# EAGLE design IC Adapter 2x20 Panel (EAGLE 9.6.2)
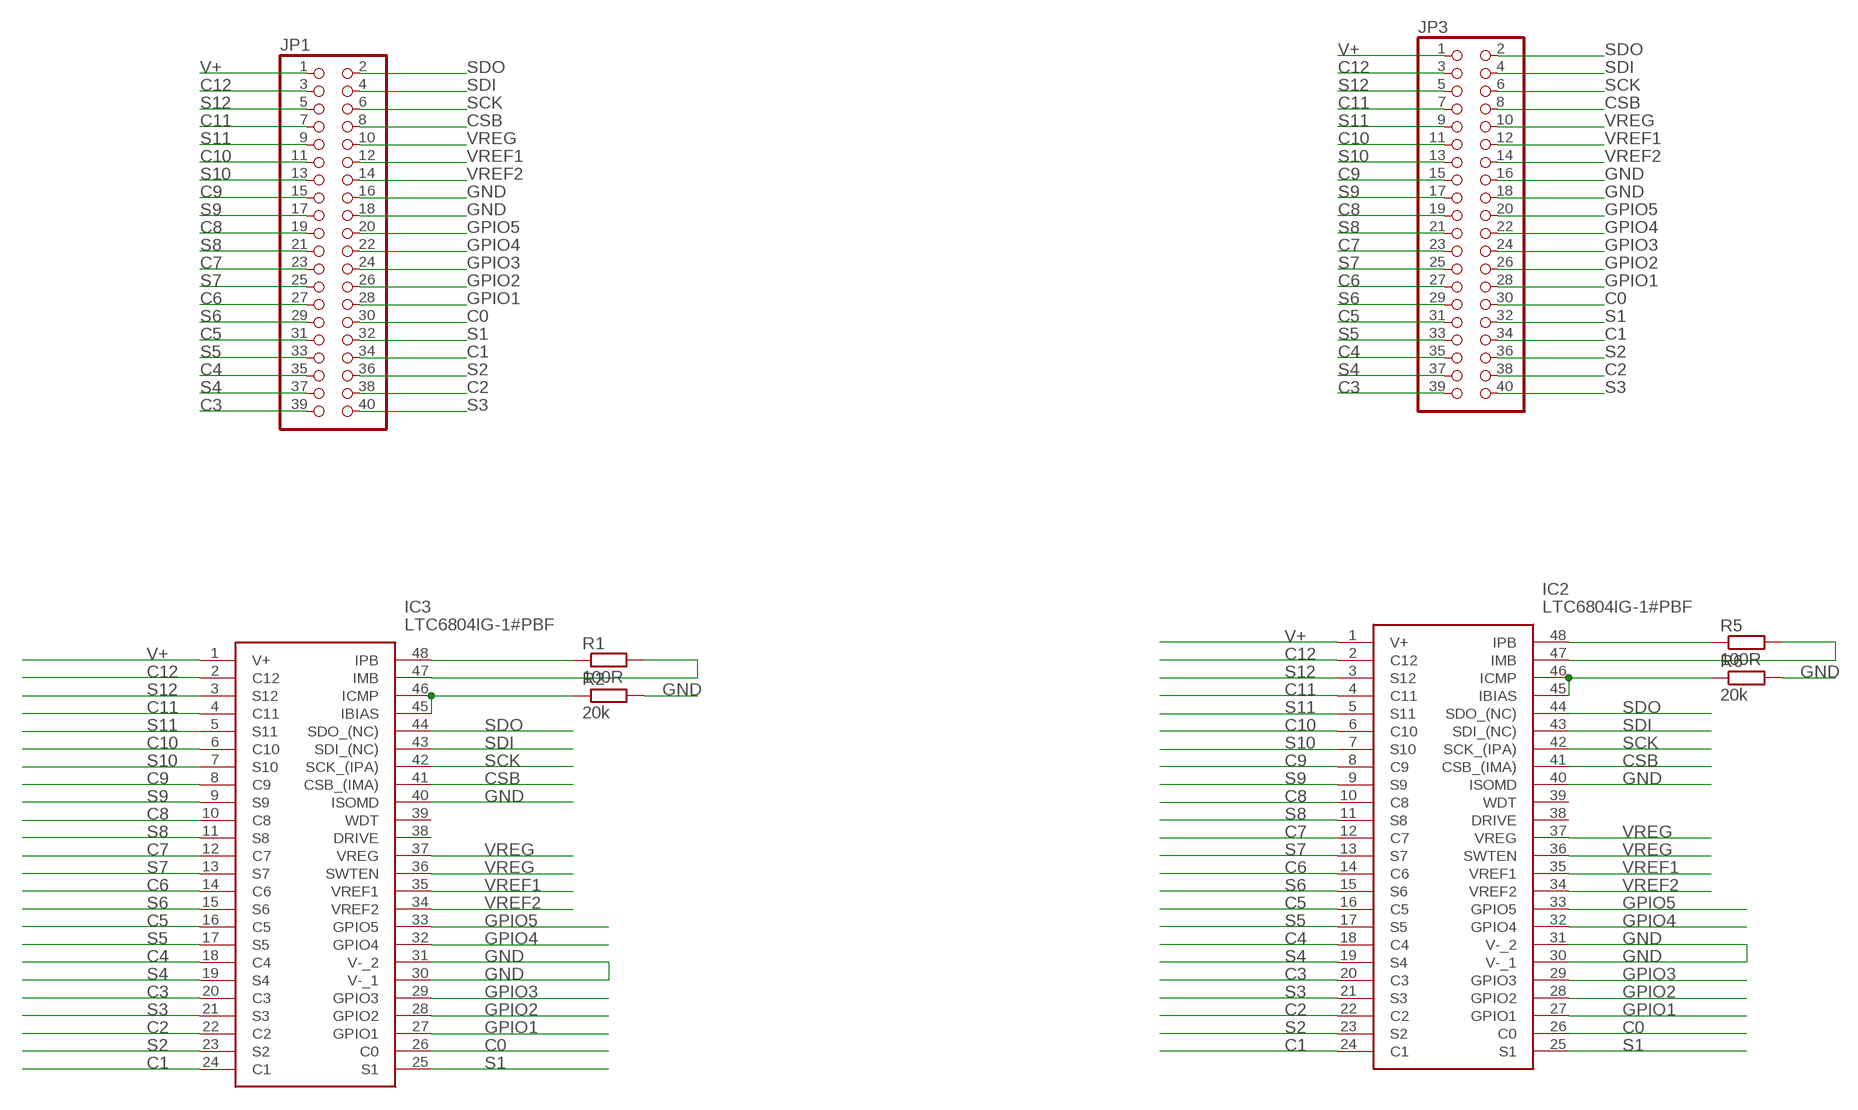
[diagram p0: schematic, sheet 1, part 1 of 2]
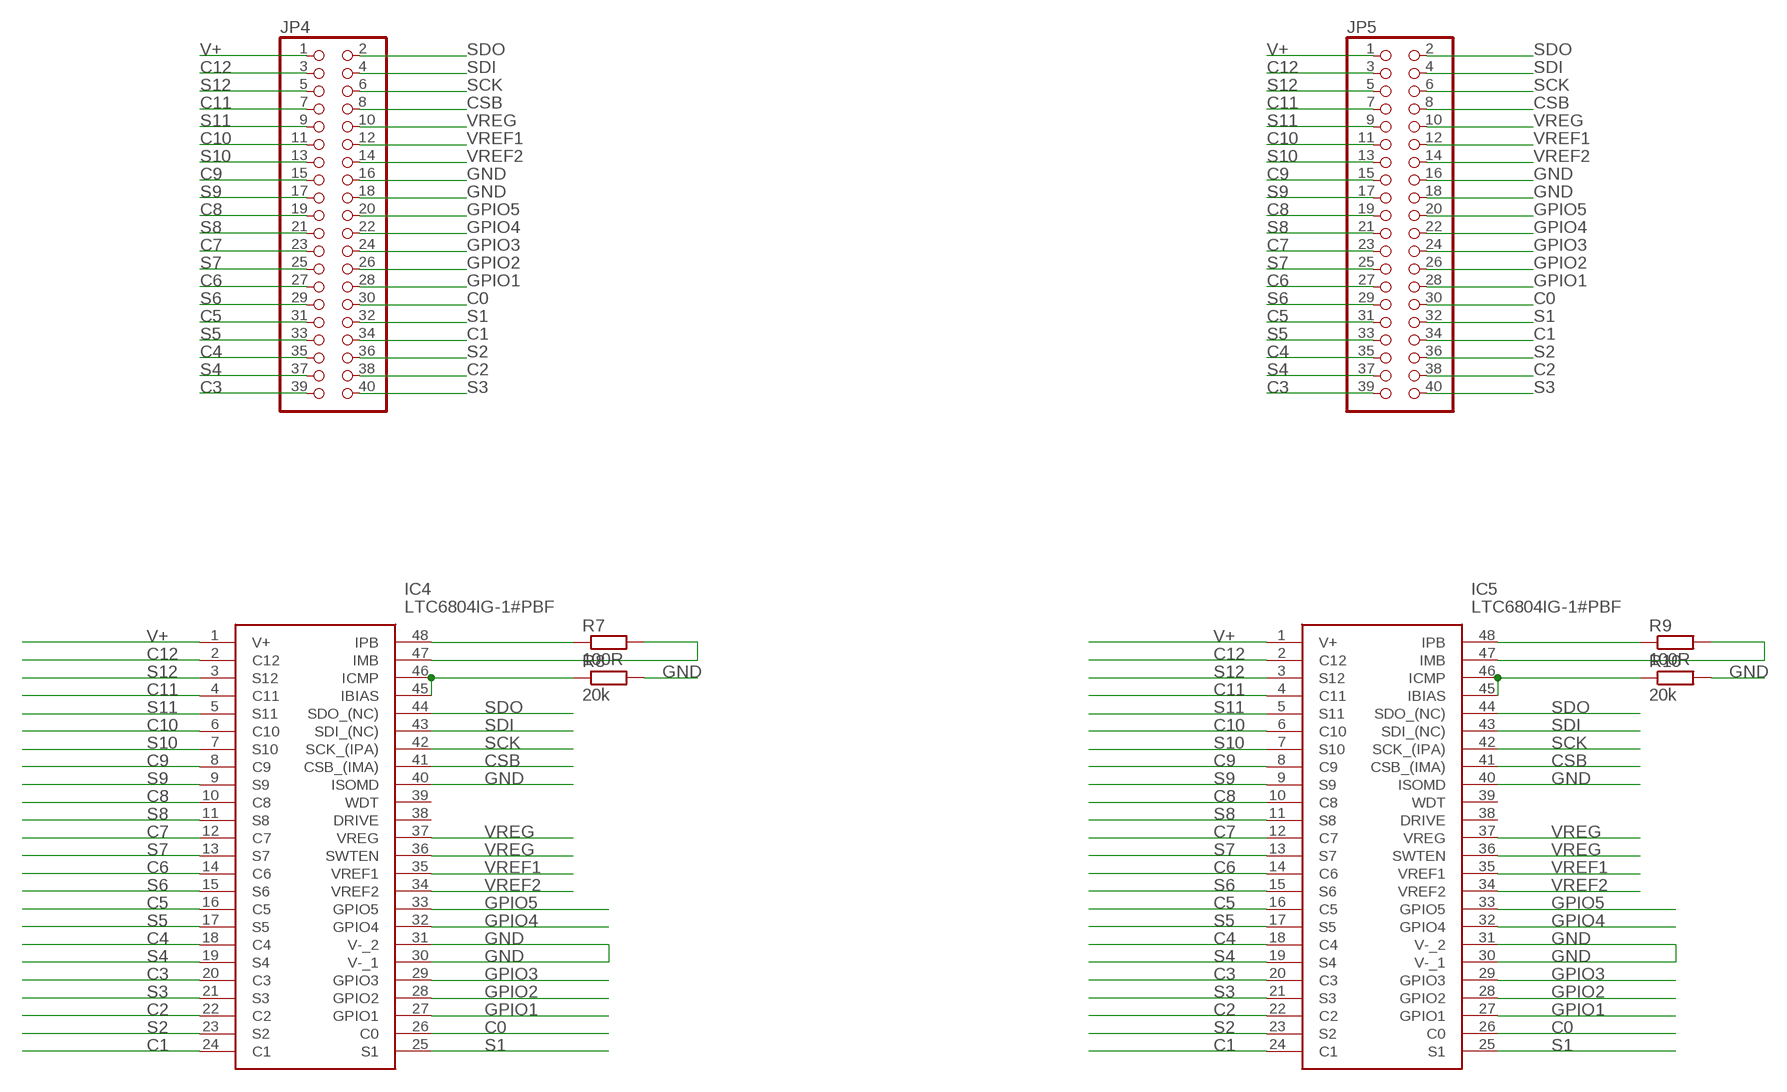
[diagram p1: schematic, sheet 1, part 2 of 2]

## Parts
IC2  LTC6804IG-1#PBF  [SOP50P780X200-48N]
IC3  LTC6804IG-1#PBF  [SOP50P780X200-48N]
IC4  LTC6804IG-1#PBF  [SOP50P780X200-48N]
IC5  LTC6804IG-1#PBF  [SOP50P780X200-48N]
JP1  PINHD-2X20  [2X20]
JP3  PINHD-2X20  [2X20]
JP4  PINHD-2X20  [2X20]
JP5  PINHD-2X20  [2X20]
R1  100R  R-EU_R0805  [R0805]
R2  20k  R-EU_R0805  [R0805]
R5  100R  R-EU_R0805  [R0805]
R6  20k  R-EU_R0805  [R0805]
R7  100R  R-EU_R0805  [R0805]
R8  20k  R-EU_R0805  [R0805]
R9  100R  R-EU_R0805  [R0805]
R10  20k  R-EU_R0805  [R0805]

## Nets
C0: IC2.26(C0) IC3.26(C0) IC4.26(C0) IC5.26(C0) JP1.30 JP3.30 JP4.30 JP5.30
C1: IC2.24(C1) IC3.24(C1) IC4.24(C1) IC5.24(C1) JP1.34 JP3.34 JP4.34 JP5.34
C2: IC2.22(C2) IC3.22(C2) IC4.22(C2) IC5.22(C2) JP1.38 JP3.38 JP4.38 JP5.38
C3: IC2.20(C3) IC3.20(C3) IC4.20(C3) IC5.20(C3) JP1.39 JP3.39 JP4.39 JP5.39
C4: IC2.18(C4) IC3.18(C4) IC4.18(C4) IC5.18(C4) JP1.35 JP3.35 JP4.35 JP5.35
C5: IC2.16(C5) IC3.16(C5) IC4.16(C5) IC5.16(C5) JP1.31 JP3.31 JP4.31 JP5.31
C6: IC2.14(C6) IC3.14(C6) IC4.14(C6) IC5.14(C6) JP1.27 JP3.27 JP4.27 JP5.27
C7: IC2.12(C7) IC3.12(C7) IC4.12(C7) IC5.12(C7) JP1.23 JP3.23 JP4.23 JP5.23
C8: IC2.10(C8) IC3.10(C8) IC4.10(C8) IC5.10(C8) JP1.19 JP3.19 JP4.19 JP5.19
C9: IC2.8(C9) IC3.8(C9) IC4.8(C9) IC5.8(C9) JP1.15 JP3.15 JP4.15 JP5.15
C10: IC2.6(C10) IC3.6(C10) IC4.6(C10) IC5.6(C10) JP1.11 JP3.11 JP4.11 JP5.11
C11: IC2.4(C11) IC3.4(C11) IC4.4(C11) IC5.4(C11) JP1.7 JP3.7 JP4.7 JP5.7
C12: IC2.2(C12) IC3.2(C12) IC4.2(C12) IC5.2(C12) JP1.3 JP3.3 JP4.3 JP5.3
CSB: IC2.41(CSB_(IMA)) IC3.41(CSB_(IMA)) IC4.41(CSB_(IMA)) IC5.41(CSB_(IMA)) JP1.8 JP3.8 JP4.8 JP5.8
GND: IC2.30(V-_1) IC2.31(V-_2) IC2.40(ISOMD) IC3.30(V-_1) IC3.31(V-_2) IC3.40(ISOMD) IC4.30(V-_1) IC4.31(V-_2) IC4.40(ISOMD) IC5.30(V-_1) IC5.31(V-_2) IC5.40(ISOMD) JP1.16 JP1.18 JP3.16 JP3.18 JP4.16 JP4.18 JP5.16 JP5.18 R2.2 R6.2 R8.2 R10.2
GPIO1: IC2.27(GPIO1) IC3.27(GPIO1) IC4.27(GPIO1) IC5.27(GPIO1) JP1.28 JP3.28 JP4.28 JP5.28
GPIO2: IC2.28(GPIO2) IC3.28(GPIO2) IC4.28(GPIO2) IC5.28(GPIO2) JP1.26 JP3.26 JP4.26 JP5.26
GPIO3: IC2.29(GPIO3) IC3.29(GPIO3) IC4.29(GPIO3) IC5.29(GPIO3) JP1.24 JP3.24 JP4.24 JP5.24
GPIO4: IC2.32(GPIO4) IC3.32(GPIO4) IC4.32(GPIO4) IC5.32(GPIO4) JP1.22 JP3.22 JP4.22 JP5.22
GPIO5: IC2.33(GPIO5) IC3.33(GPIO5) IC4.33(GPIO5) IC5.33(GPIO5) JP1.20 JP3.20 JP4.20 JP5.20
ICMP: IC3.45(IBIAS) IC3.46(ICMP) R2.1
ICMP2: IC2.45(IBIAS) IC2.46(ICMP) R6.1
ICMP3: IC4.45(IBIAS) IC4.46(ICMP) R8.1
ICMP4: IC5.45(IBIAS) IC5.46(ICMP) R10.1
N$1: IC3.48(IPB) R1.1
N$2: IC3.47(IMB) R1.2
N$5: IC2.48(IPB) R5.1
N$6: IC2.47(IMB) R5.2
N$7: IC4.48(IPB) R7.1
N$8: IC4.47(IMB) R7.2
N$9: IC5.48(IPB) R9.1
N$10: IC5.47(IMB) R9.2
S1: IC2.25(S1) IC3.25(S1) IC4.25(S1) IC5.25(S1) JP1.32 JP3.32 JP4.32 JP5.32
S2: IC2.23(S2) IC3.23(S2) IC4.23(S2) IC5.23(S2) JP1.36 JP3.36 JP4.36 JP5.36
S3: IC2.21(S3) IC3.21(S3) IC4.21(S3) IC5.21(S3) JP1.40 JP3.40 JP4.40 JP5.40
S4: IC2.19(S4) IC3.19(S4) IC4.19(S4) IC5.19(S4) JP1.37 JP3.37 JP4.37 JP5.37
S5: IC2.17(S5) IC3.17(S5) IC4.17(S5) IC5.17(S5) JP1.33 JP3.33 JP4.33 JP5.33
S6: IC2.15(S6) IC3.15(S6) IC4.15(S6) IC5.15(S6) JP1.29 JP3.29 JP4.29 JP5.29
S7: IC2.13(S7) IC3.13(S7) IC4.13(S7) IC5.13(S7) JP1.25 JP3.25 JP4.25 JP5.25
S8: IC2.11(S8) IC3.11(S8) IC4.11(S8) IC5.11(S8) JP1.21 JP3.21 JP4.21 JP5.21
S9: IC2.9(S9) IC3.9(S9) IC4.9(S9) IC5.9(S9) JP1.17 JP3.17 JP4.17 JP5.17
S10: IC2.7(S10) IC3.7(S10) IC4.7(S10) IC5.7(S10) JP1.13 JP3.13 JP4.13 JP5.13
S11: IC2.5(S11) IC3.5(S11) IC4.5(S11) IC5.5(S11) JP1.9 JP3.9 JP4.9 JP5.9
S12: IC2.3(S12) IC3.3(S12) IC4.3(S12) IC5.3(S12) JP1.5 JP3.5 JP4.5 JP5.5
SCK: IC2.42(SCK_(IPA)) IC3.42(SCK_(IPA)) IC4.42(SCK_(IPA)) IC5.42(SCK_(IPA)) JP1.6 JP3.6 JP4.6 JP5.6
SDI: IC2.43(SDI_(NC)) IC3.43(SDI_(NC)) IC4.43(SDI_(NC)) IC5.43(SDI_(NC)) JP1.4 JP3.4 JP4.4 JP5.4
SDO: IC2.44(SDO_(NC)) IC3.44(SDO_(NC)) IC4.44(SDO_(NC)) IC5.44(SDO_(NC)) JP1.2 JP3.2 JP4.2 JP5.2
V+: IC2.1(V+) IC3.1(V+) IC4.1(V+) IC5.1(V+) JP1.1 JP3.1 JP4.1 JP5.1
VREF1: IC2.35(VREF1) IC3.35(VREF1) IC4.35(VREF1) IC5.35(VREF1) JP1.12 JP3.12 JP4.12 JP5.12
VREF2: IC2.34(VREF2) IC3.34(VREF2) IC4.34(VREF2) IC5.34(VREF2) JP1.14 JP3.14 JP4.14 JP5.14
VREG: IC2.36(SWTEN) IC2.37(VREG) IC3.36(SWTEN) IC3.37(VREG) IC4.36(SWTEN) IC4.37(VREG) IC5.36(SWTEN) IC5.37(VREG) JP1.10 JP3.10 JP4.10 JP5.10
Unconnected: IC2.38(DRIVE) IC2.39(WDT) IC3.38(DRIVE) IC3.39(WDT) IC4.38(DRIVE) IC4.39(WDT) IC5.38(DRIVE) IC5.39(WDT)

## Library data of the parts
IC2-IC5 = SamacSys_Parts:LTC6804IG-1#PBF: Multicell Battery Monitors, 0V - 5V Source: Datasheet <http://cds.linear.com/docs/en/datasheet/680412fb.pdf>; DESCRIPTION: Multicell Battery Monitors, 0V - 5V; HEIGHT: 2mm; MANUFACTURER_NAME: Linear Technology; MANUFACTURER_PART_NUMBER: LTC6804IG-1#PBF; MOUSER_PART_NUMBER: 584-LTC6804IG-1#PBF; MOUSER_PRICE-STOCK: https://www.mouser.co.uk/ProductDetail/Analog-Devices-Linear-Technology/LTC6804IG-1PBF?qs=hVkxg5c3xu%2FdtwBTq6c3xw%3D%3D
JP1 JP3-JP5 = pinhead:PINHD-2X20: PIN HEADER
R1 R2 R5-R10 = rcl:R-EU_: RESISTOR, European symbol

## Board
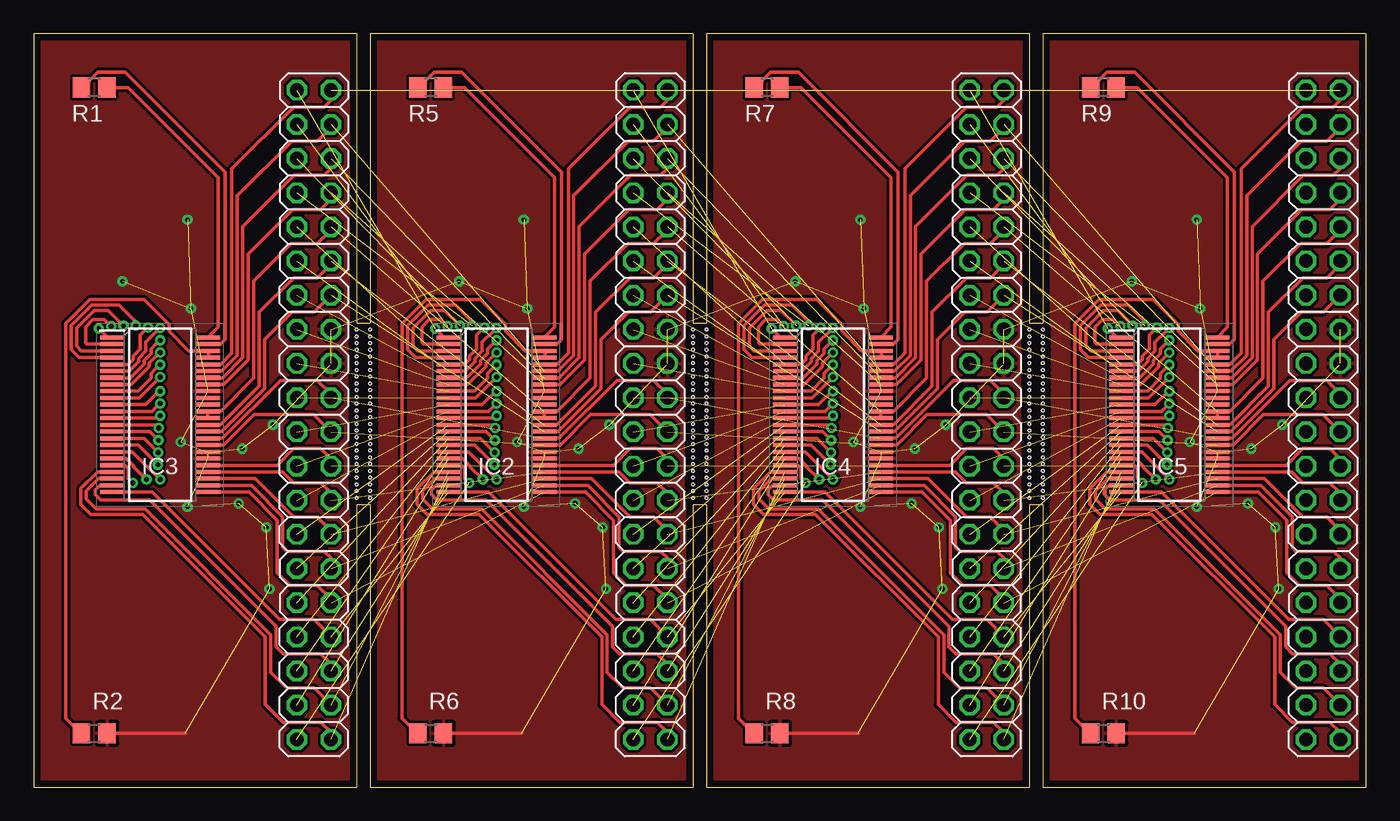
[diagram p2: board, top side]
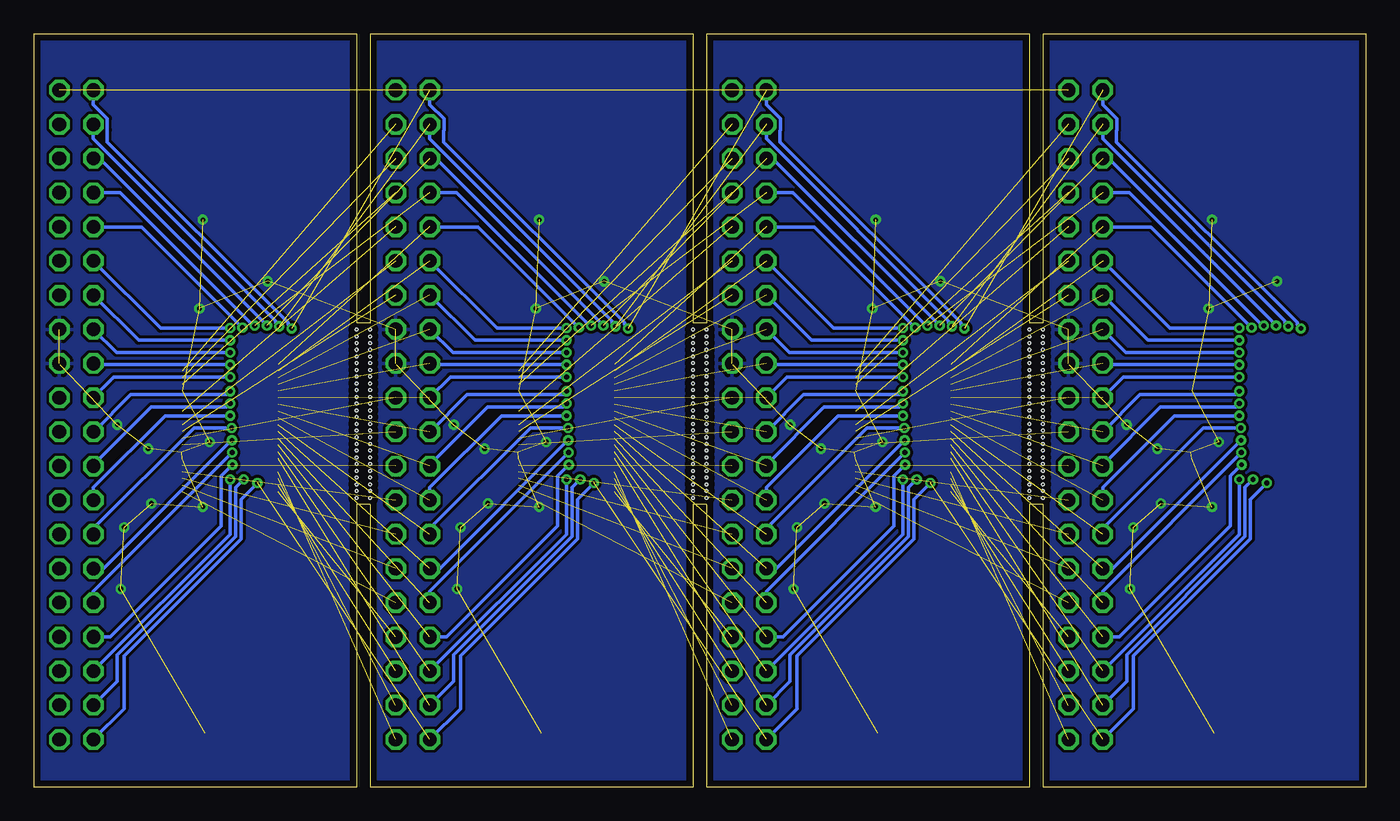
[diagram p3: board, bottom side, seen from below]

Size 99 x 56 mm. Coordinates in mm from the lower left corner, seen from the top.
Outline: 0,0 24,0 24,21 25,21 25,0 49,0 49,21 50,21 50,0 74,0 74,21 75,21 75,0 99,0 99,56 75,56 75,34.5 74,34.5 74,56 50,56 50,34.5 49,34.5 49,56 25,56 25,34.5 24,34.5 24,56 0,56 0,0
Copper layers (1*16): Top 0.07mm / dielectric 1.5mm / Bottom 0.07mm
Design rules "default *": minimum track width 10mil, minimum drill 0.35mm, track to track 6mil, track to pad 6mil, pad to pad 6mil, via to via 6mil, smd to smd 6mil, copper to edge 20mil, drill to drill 6mil, minimum pad ring 10mil, minimum via ring 8mil, stop-mask expansion 4mil, vias tented up to drill 0mil, thermal gap 10mil
Holes 0.2 mm at 24,34 25,34 25,33.5 25,33 24,33 24,33.5 24,32.5 24,32 24,31.5 24,31 25,32.5 25,32 25,31.5 25,31 25,30.5 25,30 25,29.5 25,29 25,28.5 25,28 25,27.5 25,27 25,26 25,26.5 25,24.5 25,25.5 25,25 25,23.5 25,24 25,22.5 25,23 25,21.5 24,21.5 24,22.5 24,22 25,22 24,23 24,23.5 24,24 24,24.5 24,25 24,25.5 24,26 24,26.5 24,27 24,27.5 24,28 24,28.5 24,29 24,29.5 24,30 24,30.5 49,34 50,34 50,33 50,33.5 49,33.5 49,32.5 49,33 49,31.5 49,32 50,32 50,32.5 50,31.5 50,31 50,30 50,30.5 50,29.5 50,29 50,28.5 50,28 50,27.5 50,27 50,26.5 50,26 50,25.5 50,25 50,24.5 50,24 50,23 50,23.5 50,22.5 50,22 50,21.5 49,21.5 49,22 49,22.5 49,23 49,23.5 49,24 49,24.5 49,25 49,25.5 49,26 49,26.5 49,27 49,27.5 49,28 49,28.5 49,29 49,29.5 49,30 49,30.5 49,31 74,34 75,34 75,33 75,33.5 74,33.5 74,32.5 74,33 74,31.5 74,32 75,32 75,32.5 75,31.5 75,31 75,30 75,30.5 75,29.5 75,29 75,28.5 75,28 75,27.5 75,27 75,26.5 75,26 75,25.5 75,25 75,24.5 75,24 75,23 75,23.5 75,22.5 75,22 75,21.5 74,21.5 74,22 74,22.5 74,23 74,23.5 74,24 74,24.5 74,25 74,25.5 74,26 74,26.5 74,27 74,27.5 74,28 74,28.5 74,29 74,29.5 74,30 74,30.5 74,31

### Footprints (pad centres in the part's own frame; a part is rotated, then mirrored left to right if it is on the bottom)
SOP50P780X200-48N = smd 1.8 x 0.3: 1 -3.55,5.75; 2 -3.55,5.25; 3 -3.55,4.75; 4 -3.55,4.25; 5 -3.55,3.75; 6 -3.55,3.25; 7 -3.55,2.75; 8 -3.55,2.25; 9 -3.55,1.75; 10 -3.55,1.25; 11 -3.55,0.75; 12 -3.55,0.25; 13 -3.55,-0.25; 14 -3.55,-0.75; 15 -3.55,-1.25; 16 -3.55,-1.75; 17 -3.55,-2.25; 18 -3.55,-2.75; 19 -3.55,-3.25; 20 -3.55,-3.75; 21 -3.55,-4.25; 22 -3.55,-4.75; 23 -3.55,-5.25; 24 -3.55,-5.75; 25 3.55,-5.75; 26 3.55,-5.25; 27 3.55,-4.75; 28 3.55,-4.25; 29 3.55,-3.75; 30 3.55,-3.25; 31 3.55,-2.75; 32 3.55,-2.25; 33 3.55,-1.75; 34 3.55,-1.25; 35 3.55,-0.75; 36 3.55,-0.25; 37 3.55,0.25; 38 3.55,0.75; 39 3.55,1.25; 40 3.55,1.75; 41 3.55,2.25; 42 3.55,2.75; 43 3.55,3.25; 44 3.55,3.75; 45 3.55,4.25; 46 3.55,4.75; 47 3.55,5.25; 48 3.55,5.75
2X20 = drill 1.016 octagon: 1 -24.13,-1.27; 2 -24.13,1.27; 3 -21.59,-1.27; 4 -21.59,1.27; 5 -19.05,-1.27; 6 -19.05,1.27; 7 -16.51,-1.27; 8 -16.51,1.27; 9 -13.97,-1.27; 10 -13.97,1.27; 11 -11.43,-1.27; 12 -11.43,1.27; 13 -8.89,-1.27; 14 -8.89,1.27; 15 -6.35,-1.27; 16 -6.35,1.27; 17 -3.81,-1.27; 18 -3.81,1.27; 19 -1.27,-1.27; 20 -1.27,1.27; 21 1.27,-1.27; 22 1.27,1.27; 23 3.81,-1.27; 24 3.81,1.27; 25 6.35,-1.27; 26 6.35,1.27; 27 8.89,-1.27; 28 8.89,1.27; 29 11.43,-1.27; 30 11.43,1.27; 31 13.97,-1.27; 32 13.97,1.27; 33 16.51,-1.27; 34 16.51,1.27; 35 19.05,-1.27; 36 19.05,1.27; 37 21.59,-1.27; 38 21.59,1.27; 39 24.13,-1.27; 40 24.13,1.27
R0805 = smd 1.3 x 1.5: 1 -0.95,0; 2 0.95,0

### Placement (x,y rotation side)
IC2  34.4,27.67 0 top
IC3  9.4,27.67 0 top
IC4  59.4,27.67 0 top
IC5  84.4,27.67 0 top
JP1  20.83,27.67 270 top
JP3  45.83,27.67 270 top
JP4  70.83,27.67 270 top
JP5  95.83,27.67 270 top
R1  4.5,52 180 top
R2  4.5,4 0 top
R5  29.5,52 180 top
R6  29.5,4 0 top
R7  54.5,52 180 top
R8  54.5,4 0 top
R9  79.5,52 180 top
R10  79.5,4 0 top

### Tracks (layer width: path | path; a pad name or v marks a point on that pad's centre or on a via)
C0  (3 unrouted)
  Top 0.254: JP1.30 22.1,17.02 21.59,17.53 18.79,17.53 18.52,17.8 18.52,20.09 16.19,22.42 IC3.26 | JP3.30 47.1,17.02 46.59,17.53 43.79,17.53 43.52,17.8 43.52,20.09 41.19,22.42 IC2.26 | JP4.30 72.1,17.02 71.59,17.53 68.79,17.53 68.52,17.8 68.52,20.09 66.19,22.42 IC4.26 | JP5.30 97.1,17.02 96.59,17.53 93.79,17.53 93.52,17.8 93.52,20.09 91.19,22.42 IC5.26
C1  (3 unrouted)
  Top 0.254: IC3.24 8.81,21.92 18.29,12.45 20.83,12.45 22.1,11.18 JP1.34 | IC2.24 33.81,21.92 43.29,12.45 45.83,12.45 47.1,11.18 JP3.34 | IC4.24 58.81,21.92 68.29,12.45 70.83,12.45 72.1,11.18 JP4.34 | IC5.24 83.81,21.92 93.29,12.45 95.83,12.45 97.1,11.18 JP5.34
C2  (3 unrouted)
  Top 0.254: IC3.22 4.83,22.93 3.91,22.01 3.91,21.42 4.66,20.68 8.28,20.68 17.63,11.33 17.63,8.53 18.8,7.37 20.83,7.37 22.1,6.1 JP1.38 | IC2.22 29.82,22.93 28.91,22.01 28.91,21.42 29.66,20.68 33.28,20.68 42.63,11.33 42.63,8.53 43.8,7.37 45.83,7.37 47.1,6.1 JP3.38 | IC4.22 54.83,22.93 53.91,22.01 53.91,21.42 54.66,20.68 58.28,20.68 67.63,11.33 67.63,8.53 68.8,7.37 70.83,7.37 72.1,6.1 JP4.38 | IC5.22 79.83,22.93 78.91,22.01 78.91,21.42 79.66,20.68 83.28,20.68 92.63,11.33 92.63,8.53 93.8,7.37 95.83,7.37 97.1,6.1 JP5.38
C3  (via drill 0.35)  (3 unrouted)
  Top 0.254: v7.37,22.61 7.03,22.95 7.03,23.69 6.79,23.92 IC3.20 | v32.37,22.61 32.03,22.95 32.03,23.69 31.79,23.92 IC2.20 | v57.37,22.61 57.03,22.95 57.03,23.69 56.79,23.92 IC4.20 | v82.37,22.61 82.03,22.95 82.03,23.69 81.79,23.92 IC5.20
  Bottom 0.254: v7.37,22.61 8.59,21.39 8.59,18.44 17.27,9.76 17.27,5.83 JP1.39 | v32.37,22.61 33.59,21.39 33.59,18.44 42.27,9.76 42.27,5.83 JP3.39 | v57.37,22.61 58.59,21.39 58.59,18.44 67.27,9.76 67.27,5.83 JP4.39 | v82.37,22.61 83.58,21.39 83.58,18.44 92.27,9.76 92.27,5.83 JP5.39
C4  (via drill 0.35)  (3 unrouted)
  Top 0.254: IC3.18 7.34,24.92 v9.4,22.86 | IC2.18 32.34,24.92 v34.4,22.86 | IC4.18 57.34,24.92 v59.4,22.86 | IC5.18 82.34,24.92 v84.4,22.86
  Bottom 0.254: JP1.35 9.4,18.78 v9.4,22.86 | JP3.35 34.4,18.78 v34.4,22.86 | JP4.35 59.4,18.78 v59.4,22.86 | JP5.35 84.4,18.78 v84.4,22.86
C5  (via drill 0.35)  (3 unrouted)
  Top 0.254: IC3.16 8.2,25.92 v9.25,24.87 | IC2.16 33.2,25.92 v34.25,24.87 | IC4.16 58.2,25.92 v59.25,24.87 | IC5.16 83.2,25.92 v84.25,24.87
  Bottom 0.254: JP1.31 19.56,14.56 v9.25,24.87 | JP3.31 44.56,14.56 v34.25,24.87 | JP4.31 69.56,14.56 v59.25,24.87 | JP5.31 94.56,14.56 v84.25,24.87
C6  (via drill 0.35)  (3 unrouted)
  Top 0.254: IC3.14 9.06,26.92 v9.29,26.69 | IC2.14 34.06,26.92 v34.29,26.69 | IC4.14 59.06,26.92 v59.29,26.69 | IC5.14 84.06,26.92 v84.29,26.69
  Bottom 0.254: v9.29,26.69 12.09,26.69 19.56,19.21 JP1.27 | v34.29,26.69 37.09,26.69 44.56,19.21 JP3.27 | v59.29,26.69 62.09,26.69 69.56,19.21 JP4.27 | v84.29,26.69 87.09,26.69 94.56,19.21 JP5.27
C7  (via drill 0.35)  (3 unrouted)
  Top 0.254: IC3.12 8.79,27.92 9.13,28.25 9.15,28.25 v9.4,28.5 | IC2.12 33.79,27.92 34.13,28.25 34.15,28.25 v34.4,28.5 | IC4.12 58.79,27.92 59.13,28.25 59.15,28.25 v59.4,28.5 | IC5.12 83.79,27.92 84.13,28.25 84.15,28.25 v84.4,28.5
  Bottom 0.254: v9.4,28.5 9.65,28.25 15.26,28.25 19.56,23.95 JP1.23 | v34.4,28.5 34.65,28.25 40.26,28.25 44.56,23.95 JP3.23 | v59.4,28.5 59.65,28.25 65.26,28.25 69.56,23.95 JP4.23 | v84.4,28.5 84.65,28.25 90.26,28.25 94.56,23.95 JP5.23
C8  (via drill 0.35)  (3 unrouted)
  Top 0.254: v9.4,30.48 7.84,28.93 IC3.10 | v34.4,30.48 32.84,28.93 IC2.10 | v59.4,30.48 57.84,28.93 IC4.10 | v84.4,30.48 82.84,28.93 IC5.10
  Bottom 0.254: JP1.19 19.56,28.96 18.03,30.48 v9.4,30.48 | JP3.19 44.56,28.96 43.03,30.48 v34.4,30.48 | JP4.19 69.56,28.96 68.03,30.48 v59.4,30.48 | JP5.19 94.56,28.96 93.03,30.48 v84.4,30.48
C9  (via drill 0.35)  (3 unrouted)
  Top 0.254: IC3.8 7.25,29.92 8.61,31.27 8.61,31.53 9.13,32.05 9.15,32.05 v9.4,32.3 | IC2.8 32.25,29.92 33.61,31.27 33.61,31.53 34.13,32.05 34.15,32.05 v34.4,32.3 | IC4.8 57.25,29.92 58.61,31.27 58.61,31.53 59.13,32.05 59.15,32.05 v59.4,32.3 | IC5.8 82.25,29.92 83.61,31.27 83.61,31.53 84.13,32.05 84.15,32.05 v84.4,32.3
  Bottom 0.254: v9.4,32.3 17.84,32.3 JP1.15 | v34.4,32.3 42.84,32.3 JP3.15 | v59.4,32.3 67.84,32.3 JP4.15 | v84.4,32.3 92.84,32.3 JP5.15
C10  (via drill 0.35)  (3 unrouted)
  Top 0.254: v9.4,34.12 9.15,33.86 9.13,33.86 8.33,33.07 8.33,32.4 7.79,31.86 7.79,31.61 7.1,30.91 IC3.6 | v34.4,34.12 34.15,33.86 34.13,33.86 33.33,33.07 33.33,32.4 32.79,31.86 32.79,31.61 32.1,30.91 IC2.6 | v59.4,34.12 59.15,33.86 59.13,33.86 58.33,33.07 58.33,32.4 57.79,31.86 57.79,31.61 57.1,30.91 IC4.6 | v84.4,34.12 84.15,33.86 84.13,33.86 83.33,33.07 83.33,32.4 82.79,31.86 82.79,31.61 82.1,30.91 IC5.6
  Bottom 0.254: v9.4,34.12 14.57,34.12 JP1.11 | v34.4,34.12 39.57,34.12 JP3.11 | v59.4,34.12 64.57,34.12 JP4.11 | v84.4,34.12 89.57,34.12 JP5.11
C11  (via drill 0.35)  (3 unrouted)
  Top 0.254: IC3.4 3.39,31.92 2.79,32.51 2.79,34.29 4.32,35.81 6.35,35.81 7.58,34.58 v7.58,34.29 | IC2.4 28.39,31.92 27.79,32.51 27.79,34.29 29.32,35.81 31.35,35.81 32.58,34.58 v32.58,34.29 | IC4.4 53.39,31.92 52.79,32.51 52.79,34.29 54.32,35.81 56.35,35.81 57.58,34.58 v57.58,34.29 | IC5.4 78.39,31.92 77.79,32.51 77.79,34.29 79.32,35.81 81.35,35.81 82.58,34.58 v82.58,34.29
  Bottom 0.254: v7.58,34.29 7.69,34.29 17.58,44.18 JP1.7 | v32.58,34.29 32.69,34.29 42.58,44.18 JP3.7 | v57.58,34.29 57.69,34.29 67.58,44.18 JP4.7 | v82.58,34.29 82.69,34.29 92.58,44.18 JP5.7
C12  (via drill 0.35)  (3 unrouted)
  Top 0.254: IC3.2 3.96,32.92 3.86,33.02 3.86,34.21 4.4,34.75 5.26,34.75 5.4,34.61 v5.76,34.24 | IC2.2 28.96,32.92 28.86,33.02 28.86,34.21 29.4,34.75 30.26,34.75 30.4,34.61 v30.76,34.24 | IC4.2 53.96,32.92 53.86,33.02 53.86,34.21 54.4,34.75 55.26,34.75 55.4,34.61 v55.76,34.24 | IC5.2 78.96,32.92 78.86,33.02 78.86,34.21 79.4,34.75 80.26,34.75 80.4,34.61 v80.76,34.24
  Bottom 0.254: v5.76,34.24 6.01,34.49 6.01,34.65 19.56,48.19 JP1.3 | v30.76,34.24 31.01,34.49 31.01,34.65 44.56,48.19 JP3.3 | v55.76,34.24 56.01,34.49 56.01,34.65 69.56,48.19 JP4.3 | v80.76,34.24 81.01,34.49 81.01,34.65 94.56,48.19 JP5.3
CSB  (3 unrouted)
  Top 0.254: IC3.41 14.11,29.91 15.95,31.75 15.95,39.62 19.25,42.93 21.34,42.93 22.1,43.69 JP1.8 | IC2.41 39.11,29.91 40.95,31.75 40.95,39.62 44.25,42.93 46.34,42.93 47.1,43.69 JP3.8 | IC4.41 64.11,29.91 65.95,31.75 65.95,39.62 69.25,42.93 71.34,42.93 72.1,43.69 JP4.8 | IC5.41 89.11,29.91 90.95,31.75 90.95,39.62 94.25,42.93 96.34,42.93 97.1,43.69 JP5.8
GND  (via drill 0.35)  (63 unrouted)
  Top 0.254: 11.25,4 R2.2 | 13,24.88 IC3.31 | 36.25,4 R6.2 | 38,24.88 IC2.31 | 61.25,4 R8.2 | 63,24.88 IC4.31 | 86.25,4 R10.2 | 88,24.88 IC5.31
  Bottom 0.254: 22.04,31.38 JP1.18 | 47.04,31.38 JP3.18 | 72.04,31.38 JP4.18 | 97.04,31.38 JP5.18
  other vias: 11.68,35.56 11.43,20.83 17.53,14.73 15.49,25.15 17.78,26.92 6.6,37.59 11.43,42.16 15.24,21.08 17.27,19.3 10.92,25.65 36.68,35.56 36.43,20.83 42.53,14.73 40.49,25.15 42.78,26.92 31.6,37.59 36.43,42.16 40.24,21.08 42.27,19.3 35.92,25.65 61.68,35.56 61.43,20.83 67.53,14.73 65.49,25.15 67.78,26.92 56.6,37.59 61.43,42.16 65.24,21.08 67.27,19.3 60.92,25.65 86.68,35.56 86.43,20.83 92.53,14.73 90.49,25.15 92.78,26.92 81.6,37.59 86.43,42.16 90.24,21.08 92.27,19.3 85.92,25.65
  pour Top (isolate 0.2): 0,55.88 24.13,55.88 24.13,0 0,0
  pour Bottom (isolate 0.2): 0,55.88 24.13,55.88 24.13,0 -0.25,0
  pour Top (isolate 0.2): 25,55.88 49.13,55.88 49.13,0 25,0
  pour Bottom (isolate 0.2): 25,55.88 49.13,55.88 49.13,0 24.75,0
  pour Top (isolate 0.2): 50,55.88 74.13,55.88 74.13,0 50,0
  pour Bottom (isolate 0.2): 50,55.88 74.13,55.88 74.13,0 49.75,0
  pour Top (isolate 0.2): 75,55.88 99.13,55.88 99.13,0 75,0
  pour Bottom (isolate 0.2): 75,55.88 99.13,55.88 99.13,0 74.75,0
GPIO1  (3 unrouted)
  Top 0.254: IC3.27 16.45,22.92 19.3,20.07 21.08,20.07 22.1,19.05 JP1.28 | IC2.27 41.45,22.92 44.3,20.07 46.08,20.07 47.1,19.05 JP3.28 | IC4.27 66.45,22.92 69.3,20.07 71.08,20.07 72.1,19.05 JP4.28 | IC5.27 91.45,22.92 94.3,20.07 96.08,20.07 97.1,19.05 JP5.28
GPIO2  (3 unrouted)
  Top 0.254: IC3.28 18.49,23.42 19.3,22.61 21.34,22.61 22.1,21.84 JP1.26 | IC2.28 43.49,23.42 44.3,22.61 46.34,22.61 47.1,21.84 JP3.26 | IC4.28 68.49,23.42 69.3,22.61 71.34,22.61 72.1,21.84 JP4.26 | IC5.28 93.49,23.42 94.3,22.61 96.34,22.61 97.1,21.84 JP5.26
GPIO3  (3 unrouted)
  Top 0.254: IC3.29 18.08,23.92 19.3,25.15 21.34,25.15 22.1,24.38 JP1.24 | IC2.29 43.08,23.92 44.3,25.15 46.34,25.15 47.1,24.38 JP3.24 | IC4.29 68.08,23.92 69.3,25.15 71.34,25.15 72.1,24.38 JP4.24 | IC5.29 93.08,23.92 94.3,25.15 96.34,25.15 97.1,24.38 JP5.24
GPIO4  (3 unrouted)
  Top 0.254: IC3.32 12.97,25.44 14.14,25.44 16.38,27.69 20.81,27.69 JP1.22 | IC2.32 37.97,25.44 39.14,25.44 41.38,27.69 45.81,27.69 JP3.22 | IC4.32 62.97,25.44 64.14,25.44 66.38,27.69 70.81,27.69 JP4.22 | IC5.32 87.97,25.44 89.14,25.44 91.38,27.69 95.81,27.69 JP5.22
GPIO5  (3 unrouted)
  Top 0.254: IC3.33 12.97,25.94 14.06,25.94 18.35,30.23 21.08,30.23 22.1,29.21 JP1.20 | IC2.33 37.97,25.94 39.06,25.94 43.35,30.23 46.08,30.23 47.1,29.21 JP3.20 | IC4.33 62.97,25.94 64.06,25.94 68.35,30.23 71.08,30.23 72.1,29.21 JP4.20 | IC5.33 87.97,25.94 89.06,25.94 93.35,30.23 96.08,30.23 97.1,29.21 JP5.20
ICMP
  Top 0.254: R2.1 3.5,4 2.38,5.12 2.38,34.45 4.15,36.22 8.22,36.22 10.06,34.39 10.06,33.89 11.52,32.42 IC3.46 13,32.38 13,32 IC3.45
ICMP2
  Top 0.254: R6.1 28.5,4 27.38,5.12 27.38,34.45 29.15,36.22 33.22,36.22 35.06,34.39 35.06,33.89 36.52,32.42 IC2.46 38,32.38 38,32 IC2.45
ICMP3
  Top 0.254: R8.1 53.5,4 52.38,5.12 52.38,34.45 54.15,36.22 58.22,36.22 60.06,34.39 60.06,33.89 61.52,32.42 IC4.46 63,32.38 63,32 IC4.45
ICMP4
  Top 0.254: R10.1 78.5,4 77.38,5.12 77.38,34.45 79.15,36.22 83.22,36.22 85.06,34.39 85.06,33.89 86.52,32.42 IC5.46 88,32.38 88,32 IC5.45
N$1
  Top 0.254: R1.1 7.02,52 13.71,45.31 13.71,34.18 IC3.48
N$2
  Top 0.254: R1.2 3.62,52 4.75,53.12 6.82,53.12 14.22,45.72 14.22,33.25 13.86,32.89 12.98,32.89 IC3.47
N$5
  Top 0.254: R5.1 32.02,52 38.71,45.31 38.71,34.18 IC2.48
N$6
  Top 0.254: R5.2 28.62,52 29.75,53.12 31.82,53.12 39.22,45.72 39.22,33.25 38.86,32.89 37.98,32.89 IC2.47
N$7
  Top 0.254: R7.1 57.02,52 63.71,45.31 63.71,34.18 IC4.48
N$8
  Top 0.254: R7.2 53.62,52 54.75,53.12 56.82,53.12 64.22,45.72 64.22,33.25 63.86,32.89 62.98,32.89 IC4.47
N$9
  Top 0.254: R9.1 82.02,52 88.71,45.31 88.71,34.18 IC5.48
N$10
  Top 0.254: R9.2 78.62,52 79.75,53.12 81.82,53.12 89.22,45.72 89.22,33.25 88.86,32.89 87.98,32.89 IC5.47
S1  (3 unrouted)
  Top 0.254: JP1.32 22.1,13.97 21.08,14.99 19.05,14.99 18.11,15.93 18.11,19.81 16,21.92 IC3.25 | JP3.32 47.1,13.97 46.08,14.99 44.05,14.99 43.11,15.93 43.11,19.81 41,21.92 IC2.25 | JP4.32 72.1,13.97 71.08,14.99 69.05,14.99 68.11,15.93 68.11,19.81 66,21.92 IC4.25 | JP5.32 97.1,13.97 96.08,14.99 94.05,14.99 93.11,15.93 93.11,19.81 91,21.92 IC5.25
S2  (3 unrouted)
  Top 0.254: IC3.23 4.89,22.42 4.57,22.1 4.57,21.75 4.99,21.34 8.64,21.34 18.03,11.94 18.03,10.41 18.54,9.91 21.34,9.91 22.1,9.14 JP1.36 | IC2.23 29.89,22.42 29.57,22.1 29.57,21.75 29.99,21.34 33.64,21.34 43.03,11.94 43.03,10.41 43.54,9.91 46.34,9.91 47.1,9.14 JP3.36 | IC4.23 54.89,22.42 54.57,22.1 54.57,21.75 54.99,21.34 58.64,21.34 68.03,11.94 68.03,10.41 68.54,9.91 71.34,9.91 72.1,9.14 JP4.36 | IC5.23 79.89,22.42 79.57,22.1 79.57,21.75 79.99,21.34 83.64,21.34 93.03,11.94 93.03,10.41 93.54,9.91 96.34,9.91 97.1,9.14 JP5.36
S3  (3 unrouted)
  Top 0.254: IC3.21 4.75,23.43 3.5,22.18 3.5,21 4.24,20.27 8.11,20.27 17.22,11.16 17.22,6.15 18.54,4.83 21.34,4.83 22.1,4.06 JP1.40 | IC2.21 29.75,23.43 28.5,22.18 28.5,21 29.23,20.27 33.11,20.27 42.22,11.16 42.22,6.15 43.54,4.83 46.34,4.83 47.1,4.06 JP3.40 | IC4.21 54.75,23.43 53.51,22.18 53.51,21 54.23,20.27 58.11,20.27 67.22,11.16 67.22,6.15 68.54,4.83 71.34,4.83 72.1,4.06 JP4.40 | IC5.21 79.75,23.43 78.5,22.18 78.5,21 79.23,20.27 83.11,20.27 92.22,11.16 92.22,6.15 93.54,4.83 96.34,4.83 97.1,4.06 JP5.40
S4  (via drill 0.35)  (3 unrouted)
  Top 0.254: v8.38,22.86 7.43,23.81 7.43,23.85 6.87,24.42 IC3.19 | v33.38,22.86 32.43,23.81 32.43,23.85 31.87,24.42 IC2.19 | v58.38,22.86 57.43,23.81 57.43,23.85 56.87,24.42 IC4.19 | v83.38,22.86 82.43,23.81 82.43,23.85 81.87,24.42 IC5.19
  Bottom 0.254: v8.38,22.86 8.99,22.25 8.99,18.61 17.78,9.82 17.78,7.86 JP1.37 | v33.38,22.86 33.99,22.25 33.99,18.61 42.78,9.82 42.78,7.86 JP3.37 | v58.38,22.86 58.99,22.25 58.99,18.61 67.78,9.82 67.78,7.86 JP4.37 | v83.38,22.86 83.99,22.25 83.99,18.61 92.78,9.82 92.78,7.86 JP5.37
S5  (via drill 0.35)  (3 unrouted)
  Top 0.254: IC3.17 7.77,25.42 v9.23,23.96 | IC2.17 32.77,25.42 v34.23,23.96 | IC4.17 57.77,25.42 v59.23,23.96 | IC5.17 82.77,25.42 v84.23,23.96
  Bottom 0.254: v9.23,23.96 10.06,23.13 10.06,19.41 18.3,11.16 JP1.33 | v34.23,23.96 35.06,23.13 35.06,19.41 43.3,11.16 JP3.33 | v59.23,23.96 60.06,23.13 60.06,19.41 68.3,11.16 JP4.33 | v84.23,23.96 85.06,23.13 85.06,19.41 93.3,11.16 JP5.33
S6  (via drill 0.35)  (3 unrouted)
  Top 0.254: IC3.15 8.63,26.42 v9.27,25.78 | IC2.15 33.63,26.42 v34.27,25.78 | IC4.15 58.63,26.42 v59.27,25.78 | IC5.15 83.63,26.42 v84.27,25.78
  Bottom 0.254: v9.27,25.78 18.81,16.24 JP1.29 | v34.27,25.78 43.81,16.24 JP3.29 | v59.27,25.78 68.81,16.24 JP4.29 | v84.27,25.78 93.81,16.24 JP5.29
S7  (via drill 0.35)  (3 unrouted)
  Top 0.254: v9.4,27.59 9.25,27.59 9.1,27.44 5.87,27.44 IC3.13 | v34.4,27.59 34.25,27.59 34.1,27.44 30.87,27.44 IC2.13 | v59.4,27.59 59.25,27.59 59.1,27.44 55.87,27.44 IC4.13 | v84.4,27.59 84.25,27.59 84.1,27.44 80.87,27.44 IC5.13
  Bottom 0.254: JP1.25 19.56,22.26 14.22,27.59 v9.4,27.59 | JP3.25 44.56,22.26 39.22,27.59 v34.4,27.59 | JP4.25 69.56,22.26 64.22,27.59 v59.4,27.59 | JP5.25 94.56,22.26 89.22,27.59 v84.4,27.59
S8  (via drill 0.35)  (3 unrouted)
  Top 0.254: IC3.11 5.87,28.44 8.34,28.44 9.31,29.41 v9.4,29.41 | IC2.11 30.87,28.44 33.34,28.44 34.31,29.41 v34.4,29.41 | IC4.11 55.87,28.44 58.34,28.44 59.31,29.41 v59.4,29.41 | IC5.11 80.87,28.44 83.34,28.44 84.31,29.41 v84.4,29.41
  Bottom 0.254: v9.4,29.41 9.65,29.16 16.78,29.16 19.54,26.4 JP1.21 | v34.4,29.41 34.65,29.16 41.78,29.16 44.54,26.4 JP3.21 | v59.4,29.41 59.65,29.16 66.78,29.16 69.54,26.4 JP4.21 | v84.4,29.41 84.65,29.16 91.78,29.16 94.54,26.4 JP5.21
S9  (via drill 0.35)  (3 unrouted)
  Top 0.254: IC3.9 5.87,29.44 7.78,29.44 8.74,30.4 8.74,30.75 9.13,31.14 9.15,31.14 v9.4,31.39 | IC2.9 30.87,29.44 32.78,29.44 33.74,30.4 33.74,30.75 34.13,31.14 34.15,31.14 v34.4,31.39 | IC4.9 55.87,29.44 57.78,29.44 58.74,30.4 58.74,30.75 59.13,31.14 59.15,31.14 v59.4,31.39 | IC5.9 80.87,29.44 82.78,29.44 83.74,30.4 83.74,30.75 84.13,31.14 84.15,31.14 v84.4,31.39
  Bottom 0.254: v9.4,31.39 19.47,31.39 JP1.17 | v34.4,31.39 44.47,31.39 JP3.17 | v59.4,31.39 69.47,31.39 JP4.17 | v84.4,31.39 94.47,31.39 JP5.17
S10  (via drill 0.35)  (3 unrouted)
  Top 0.254: IC3.7 7.17,30.41 8.2,31.44 8.2,31.7 8.74,32.24 8.74,32.57 9.13,32.95 9.15,32.95 v9.4,33.21 | IC2.7 32.17,30.41 33.2,31.44 33.2,31.7 33.74,32.24 33.74,32.57 34.13,32.95 34.15,32.95 v34.4,33.21 | IC4.7 57.17,30.41 58.2,31.44 58.2,31.7 58.74,32.24 58.74,32.57 59.13,32.95 59.15,32.95 v59.4,33.21 | IC5.7 82.17,30.41 83.2,31.44 83.2,31.7 83.74,32.24 83.74,32.57 84.13,32.95 84.15,32.95 v84.4,33.21
  Bottom 0.254: v9.4,33.21 16.2,33.21 JP1.13 | v34.4,33.21 41.2,33.21 JP3.13 | v59.4,33.21 66.2,33.21 JP4.13 | v84.4,33.21 91.2,33.21 JP5.13
S11  (via drill 0.35)  (3 unrouted)
  Top 0.254: IC3.5 7.02,31.41 7.39,31.78 7.39,32.03 7.93,32.57 7.93,33.6 v8.49,34.16 | IC2.5 32.02,31.41 32.39,31.78 32.39,32.03 32.93,32.57 32.93,33.6 v33.49,34.16 | IC4.5 57.02,31.41 57.39,31.78 57.39,32.03 57.93,32.57 57.93,33.6 v58.49,34.16 | IC5.5 82.02,31.41 82.39,31.78 82.39,32.03 82.93,32.57 82.93,33.6 v83.49,34.16
  Bottom 0.254: JP1.9 19.54,41.62 15.98,41.62 8.51,34.16 v8.49,34.16 | JP3.9 44.54,41.62 40.98,41.62 33.51,34.16 v33.49,34.16 | JP4.9 69.54,41.62 65.98,41.62 58.51,34.16 v58.49,34.16 | JP5.9 94.54,41.62 90.98,41.62 83.51,34.16 v83.49,34.16
S12  (via drill 0.35)  (3 unrouted)
  Top 0.254: IC3.3 3.55,32.42 3.2,32.77 3.2,34.12 4.49,35.41 5.55,35.41 v6.67,34.29 | IC2.3 28.55,32.42 28.2,32.77 28.2,34.12 29.49,35.41 30.55,35.41 v31.67,34.29 | IC4.3 53.55,32.42 53.2,32.77 53.2,34.12 54.49,35.41 55.55,35.41 v56.67,34.29 | IC5.3 78.55,32.42 78.2,32.77 78.2,34.12 79.49,35.41 80.55,35.41 v81.67,34.29
  Bottom 0.254: v6.67,34.29 6.92,34.54 6.92,34.56 19.08,46.72 JP1.5 | v31.67,34.29 31.92,34.54 31.92,34.56 44.08,46.72 JP3.5 | v56.67,34.29 56.92,34.54 56.92,34.56 69.08,46.72 JP4.5 | v81.67,34.29 81.92,34.54 81.92,34.56 94.08,46.72 JP5.5
SCK  (3 unrouted)
  Top 0.254: IC3.42 14.04,30.41 15.54,31.92 15.54,41.66 19.36,45.47 21.59,45.47 22.1,45.97 JP1.6 | IC2.42 39.04,30.41 40.55,31.92 40.55,41.66 44.35,45.47 46.59,45.47 47.1,45.97 JP3.6 | IC4.42 64.04,30.41 65.55,31.92 65.55,41.66 69.36,45.47 71.59,45.47 72.1,45.97 JP4.6 | IC5.42 89.04,30.41 90.55,31.92 90.55,41.66 94.36,45.47 96.59,45.47 97.1,45.97 JP5.6
SDI  (3 unrouted)
  Top 0.254: IC3.43 13.96,30.92 15.14,32.09 15.14,43.94 19.2,48.01 21.08,48.01 22.1,49.02 JP1.4 | IC2.43 38.96,30.92 40.14,32.09 40.14,43.94 44.2,48.01 46.08,48.01 47.1,49.02 JP3.4 | IC4.43 63.96,30.92 65.14,32.09 65.14,43.94 69.2,48.01 71.08,48.01 72.1,49.02 JP4.4 | IC5.43 88.96,30.92 90.14,32.09 90.14,43.94 94.2,48.01 96.08,48.01 97.1,49.02 JP5.4
SDO  (3 unrouted)
  Top 0.254: IC3.44 13.89,31.41 14.73,32.26 14.73,45.97 19.3,50.55 21.59,50.55 22.1,51.05 JP1.2 | IC2.44 38.89,31.41 39.73,32.26 39.73,45.97 44.3,50.55 46.59,50.55 47.1,51.05 JP3.2 | IC4.44 63.89,31.41 64.73,32.26 64.73,45.97 69.3,50.55 71.59,50.55 72.1,51.05 JP4.2 | IC5.44 88.89,31.41 89.73,32.26 89.73,45.97 94.3,50.55 96.59,50.55 97.1,51.05 JP5.2
V+  (via drill 0.35)  (3 unrouted)
  Top 0.254: IC3.1 5.5,33.42 v4.83,34.09 | IC2.1 30.5,33.42 v29.83,34.09 | IC4.1 55.5,33.42 v54.83,34.09 | IC5.1 80.5,33.42 v79.83,34.09
  Bottom 0.254: v4.83,34.09 5.11,34.37 5.11,34.51 18.54,47.95 18.54,48.8 18.52,48.83 18.52,49.69 19.56,50.73 JP1.1 | v29.83,34.09 30.11,34.37 30.11,34.51 43.54,47.95 43.54,48.8 43.52,48.83 43.52,49.69 44.56,50.73 JP3.1 | v54.83,34.09 55.1,34.37 55.1,34.51 68.54,47.95 68.54,48.8 68.52,48.83 68.52,49.69 69.56,50.73 JP4.1 | v79.83,34.09 80.11,34.37 80.11,34.51 93.54,47.95 93.54,48.8 93.52,48.83 93.52,49.69 94.56,50.73 JP5.1
VREF1  (3 unrouted)
  Top 0.254: IC3.35 12.97,26.94 13.91,26.94 16.76,29.79 16.76,35.31 19.3,37.85 21.08,37.85 22.1,38.86 JP1.12 | IC2.35 37.97,26.94 38.91,26.94 41.76,29.79 41.76,35.31 44.3,37.85 46.08,37.85 47.1,38.86 JP3.12 | IC4.35 62.97,26.94 63.91,26.94 66.76,29.79 66.76,35.31 69.3,37.85 71.08,37.85 72.1,38.86 JP4.12 | IC5.35 87.97,26.94 88.91,26.94 91.76,29.79 91.76,35.31 94.3,37.85 96.08,37.85 97.1,38.86 JP5.12
VREF2  (3 unrouted)
  Top 0.254: IC3.34 13.96,26.42 17.17,29.62 17.17,33.27 19.2,35.31 20.84,35.31 JP1.14 | IC2.34 38.96,26.42 42.17,29.62 42.17,33.27 44.2,35.31 45.84,35.31 JP3.14 | IC4.34 63.96,26.42 67.17,29.62 67.17,33.27 69.2,35.31 70.84,35.31 JP4.14 | IC5.34 88.96,26.42 92.17,29.62 92.17,33.27 94.2,35.31 95.84,35.31 JP5.14
VREG  (3 unrouted)
  Top 0.254: IC3.36 IC3.37 13.89,27.91 16.36,30.38 16.36,37.59 19.15,40.39 21.08,40.39 22.1,41.4 JP1.10 | IC2.36 IC2.37 38.89,27.91 41.36,30.38 41.36,37.59 44.15,40.39 46.08,40.39 47.1,41.4 JP3.10 | IC4.36 IC4.37 63.89,27.91 66.36,30.38 66.36,37.59 69.15,40.39 71.08,40.39 72.1,41.4 JP4.10 | IC5.36 IC5.37 88.89,27.91 91.36,30.38 91.36,37.59 94.15,40.39 96.08,40.39 97.1,41.4 JP5.10